# EAGLE design TPT02r (EAGLE 7.5.0)
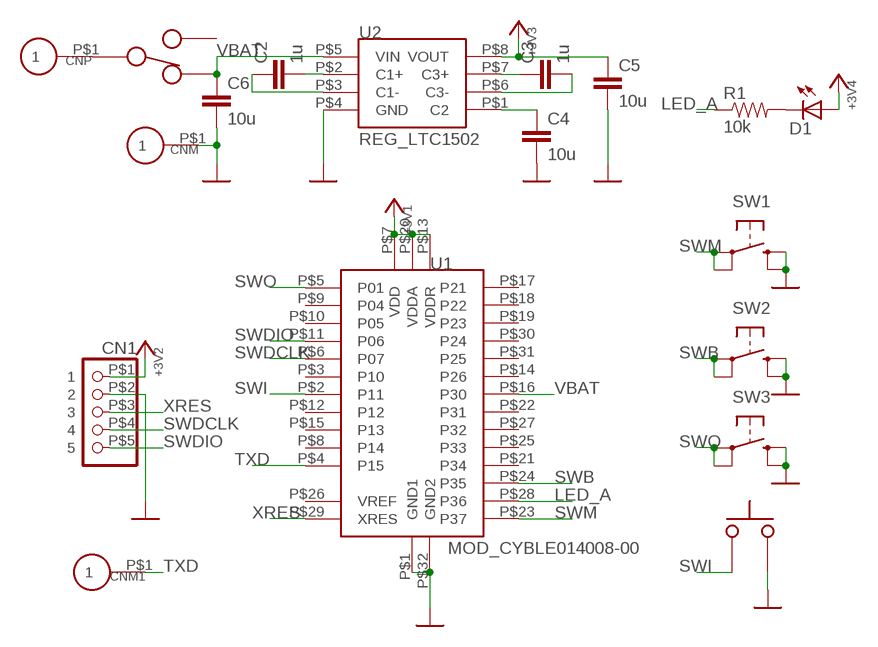
[diagram p0: schematic, sheet 1]

## Parts
C2  1u  CAP0603  [0603]
C3  1u  CAP0603  [0603]
C4  10u  CAP0603  [0603]
C5  10u  CAP0603  [0603]
C6  10u  CAP0603  [0603]
CN1  CON_PINHD-1X550MIL  [1X5_50MIL]
CNM  CON_P01SMD1MM  [PAD_SMD1MM]
CNM1  CON_P01SMD1MM  [PAD_SMD1MM]
CNP  CON_P01SMD1MM  [PAD_SMD1MM]
D1  LED0603  [SPARKFUN_LED-0603]
R1  10k  RES0603  [0603]
SW1  SW_TACTEVQP2  [SW_EVQP2]
SW2  SW_TACTTVAF17  [SW_TVAF17]
SW3  SW_TACTTVAF17  [SW_TVAF17]
SW4  SW_SLIDECUS12  [SW_CUS-12]
SW6  SW_TACT2PB3U3000  [SW_B3U-3000P]
U1  MOD_CYBLE014008-00  [MOD_CYBLE014008-00]
U2  REG_LTC1502  [MSOP8]

## Nets
+3V3: C5.1 CN1.P$1 D1.A U1.P$7(VDD) U1.P$13(VDDR) U1.P$20(VDDA) U2.P$8(VOUT) ; supply symbol labelled POW_+3V3
GND: C4.2 C5.2 C6.2 CN1.P$2 CNM.P$1 SW1.PB1(S) SW1.PB2(S1) SW2.P$3(S) SW2.P$4(S1) SW3.P$3(S) SW3.P$4(S1) SW6.P$1 U1.P$1(GND1) U1.P$32(GND2) U2.P$4(GND) ; supply symbol labelled POW_GND
LED_A: R1.1 U1.P$28(P36)
N$2: C4.1 U2.P$1(C2)
N$3: C2.2 U2.P$2(C1+)
N$4: C2.1 U2.P$3(C1-)
N$5: C3.1 U2.P$7(C3+)
N$6: C3.2 U2.P$6(C3-)
N$7: D1.C R1.2
N$8: CNP.P$1 SW4.P$2
SWB: SW2.P$1(P) SW2.P$2(P1) U1.P$24(P35)
SWDCLK: CN1.P$4 U1.P$6(P07)
SWDIO: CN1.P$5 U1.P$11(P06)
SWI: SW6.P$2 U1.P$2(P11)
SWM: SW1.PA1(P) SW1.PA2(P1) U1.P$23(P37)
SWO: SW3.P$1(P) SW3.P$2(P1) U1.P$5(P01)
TXD: CNM1.P$1 U1.P$4(P15)
VBAT: C6.1 SW4.P$1 U1.P$16(P30) U2.P$5(VIN)
XRES: CN1.P$3 U1.P$29(XRES)
Unconnected: U1.P$3(P10) U1.P$8(P14) U1.P$9(P04) U1.P$10(P05) U1.P$12(P12) U1.P$14(P26) U1.P$15(P13) U1.P$17(P21) U1.P$18(P22) U1.P$19(P23) U1.P$21(P34) U1.P$22(P31) U1.P$25(P33) U1.P$26(VREF) U1.P$27(P32) U1.P$30(P24) U1.P$31(P25)

## Power pins joined to a net without a drawn wire
P$3: SW4.P$3

## Library data of the parts
C2-C6 = akita:CAP: Capacitor Standard 0603 ceramic capacitor, and 0.1" leaded capacitor.
CN1 = akita:CON_PINHD-1X5: PIN HEADER
CNM CNM1 CNP = akita:CON_P01
D1 = akita:LED: LEDs Standard schematic elements and footprints for 5mm, 3mm, 1206, and 0603 sized LEDs. 5mm - Spark Fun Electronics SKU : COM-00529 (and others)
R1 = akita:RES: Resistor Basic schematic elements and footprints for 0603, 1206, and PTH resistors.
SW1-SW3 = akita:SW_TACT: OMRON SWITCH
SW4 = akita:SW_SLIDE
SW6 = akita:SW_TACT2P: OMRON SWITCH
U1 = akita:MOD_CYBLE014008-00: Cypress CYBLE014008-000
U2 = akita:REG_LTC1502: LinearTechnology LTC1502(-3.3), Charge-pump regulator

## Board
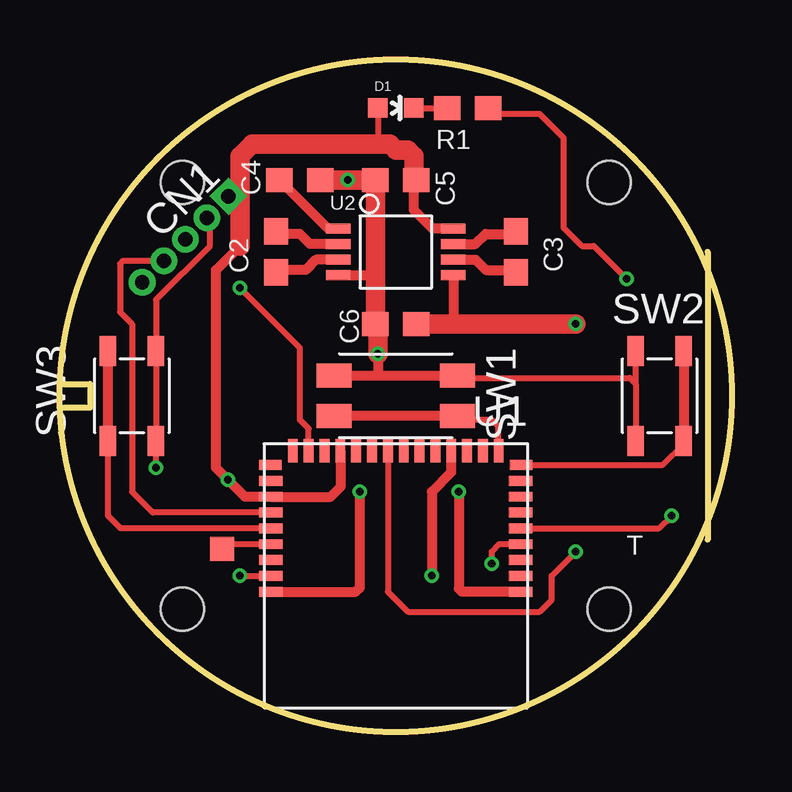
[diagram p1: board, top side]
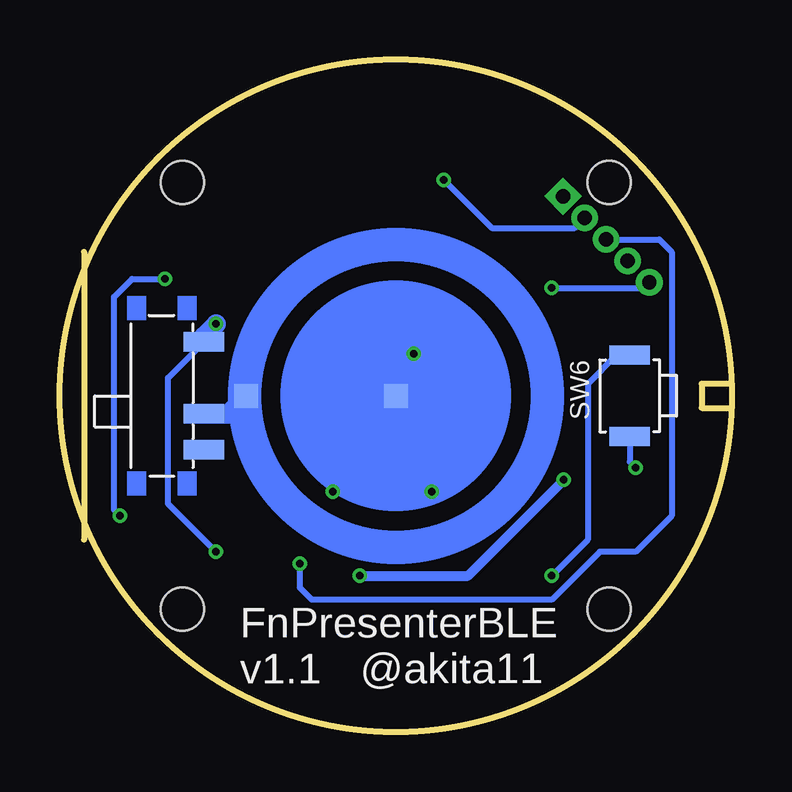
[diagram p2: board, bottom side, seen from below]

Size 28 x 28 mm. Coordinates in mm from the lower left corner, seen from the top.
Outline: 27,20 27,8
Outline: 0,14.5 1.25,14.5 1.25,13.5 0,13.5
Outline: circle at 14,14 radius 14
Copper layers (1*16): Top 0.035mm / dielectric 1.5mm / Bottom 0.035mm
Design rules "SeeedStudio_2layer_DRU_no_angle_20140221_Drill03mm": minimum track width 6mil, minimum drill 0.3mm, track to track 6mil, track to pad 6mil, pad to pad 6mil, via to via 6mil, smd to smd 0mil, copper to edge 10mil, drill to drill 10mil, minimum pad ring 10mil, minimum via ring 6mil, stop-mask expansion 2mil, vias tented up to drill 100mil, thermal gap 10mil
Holes 1.8 mm at 5.1,5.1 22.9,5.1 22.9,22.9 5.1,22.9

### Footprints (pad centres in the part's own frame; a part is rotated, then mirrored left to right if it is on the bottom)
0603 = smd 1.1 x 1: 1 -0.85,0; 2 0.85,0
1X5_50MIL = drill 0.6 square: P$1 0,2.54 | drill 0.6: P$2 0,1.27; P$3 0,0; P$4 0,-1.27; P$5 0,-2.54
PAD_SMD1MM = smd 1 x 1: P$1 0,0
SPARKFUN_LED-0603 = smd 0.8 x 0.8: A 0,-0.75; C 0,0.75
SW_EVQP2 = smd 1.45 x 1: PA1 -2.575,0.85; PA2 2.575,0.85; PB1 -2.575,-0.85; PB2 2.575,-0.85
SW_TVAF17 = smd 1.25 x 0.7: P$1 -1.875,1; P$2 1.875,1; P$3 -1.875,-1; P$4 1.875,-1
SW_CUS-12 = smd 0.813 x 1.676: P$1 -2.25,1.75; P$2 0.75,1.75; P$3 2.25,1.75
SW_B3U-3000P = smd 0.8 x 1.7: P$1 1.7,0; P$2 -1.7,0
MOD_CYBLE014008-00 = smd 0.99 x 0.41: P$1 5.205,0.67; P$2 5.205,0.01; P$3 5.205,-0.65; P$4 5.205,-1.31; P$5 5.205,-1.97; P$6 5.205,-2.63; P$7 5.205,-3.29; P$8 5.205,-3.95; P$25 -5.205,-3.95; P$26 -5.205,-3.29; P$27 -5.205,-2.63; P$28 -5.205,-1.97; P$29 -5.205,-1.31; P$30 -5.205,-0.65; P$31 -5.205,0.01; P$32 -5.205,0.67 | smd 0.94 x 0.41: P$9 5.23,-4.61; P$24 -5.23,-4.61 | smd 0.41 x 0.99: P$10 4.29,-5.205; P$11 3.63,-5.205; P$12 2.97,-5.205; P$13 2.31,-5.205; P$14 1.65,-5.205; P$15 0.99,-5.205; P$16 0.33,-5.205; P$17 -0.33,-5.205; P$18 -0.99,-5.205; P$19 -1.65,-5.205; P$20 -2.31,-5.205; P$21 -2.97,-5.205; P$22 -3.63,-5.205; P$23 -4.29,-5.205
MSOP8 = smd 0.41 x 1.02: P$1 -0.975,-2.4; P$2 -0.325,-2.4; P$3 0.325,-2.4; P$4 0.975,-2.4; P$5 0.975,2.4; P$6 0.325,2.4; P$7 -0.325,2.4; P$8 -0.975,2.4

### Placement (x,y rotation side)
C2  9,20 90 top
C3  19,20 270 top
C4  10,23 0 top
C5  14,23 180 top
C6  14,17 180 top
CN1  5.22,20.52 315 top
CNM  14,14 0 bottom
CNM1  6.75,7.62 0 top
CNP  20.25,14 0 bottom
D1  14,26 270 top
R1  17,26 180 top
SW1  14,14 180 top
SW2  25,14 270 top
SW3  3,14 90 top
SW4  23.75,14 270 bottom
SW6  4.25,14 270 bottom
U1  14,6.5 180 top
U2  14,20 270 top

### Tracks (layer width: path | path; a pad name or v marks a point on that pad's centre or on a via)
+3V3  (via drill 0.3)
  Top 0.254: 7.5,21.88 7.46,21.88 CN1.P$1 | D1.A 13.25,24.75 13.5,24.5
  Top 0.406: U2.P$8 15.53,20.98 14.75,21.75 14.75,22.9 C5.1 | 7.5,20.25 6.5,19.25 6.5,11 v7,10.5 7.71,9.79 U1.P$7 11.29,9.79 11.69,10.19 U1.P$13 | U1.P$20 16.31,10.81 15.5,10 v15.5,6.5
  Top 0.813: C5.1 14.75,23.1 14.75,24 14.5,24.25 14,24.25 13.75,24.5 13.5,24.5 8,24.5 7.5,24 7.5,21.88 7.5,20.25
  Bottom 0.406: v15.5,6.5 11,6.5 v7,10.5
GND  (via drill 0.3)
  Top 0.254: 16.68,14.75 23.75,14.75 24,14.5 | 24,14.5 SW2.P$4 | 24,14.5 SW2.P$3 | CN1.P$2 6.25,21.29 6.25,20.25 4,18 SW3.P$4 SW3.P$3 v4,11
  Top 0.406: U2.P$4 13.12,19.02 13.15,19 | SW1.PB2 13.25,14.85 | 13.25,14.85 SW1.PB1 16.68,14.75 | v13.25,15.75 13.25,14.85 | v16.62,10 16.62,5.96 16.75,5.83 U1.P$32 | U1.P$1 12.33,5.83 12.5,6 v12.5,10
  Top 0.813: v13.25,15.75 13.25,16.9 C6.2 13.15,19 C5.2 v12,23 C4.2
  Bottom 0.254: v12,23 10,21 6.54,21 CN1.P$2 | SW6.P$1 4.25,11.25 v4,11
  Bottom 0.406: CNM.P$1 16.62,11.38 v16.62,10 | CNM.P$1 12.75,12.75 12.75,10.5 12.5,10.25 v12.5,10 | 14,15 CNM.P$1
  Bottom 0.813: 14,15 v13.25,15.75
LED_A  (via drill 0.3)
  Top 0.254: R1.1 18.1,25.75 20,25.75 21,24.75 21,21 21.75,20.25 22.25,20.25 v23.62,18.88 | U1.P$28 24.97,8.47 v25.5,9
  Bottom 0.254: 23.75,18.75 v23.62,18.88 25,18.88 25.75,18.12 25.75,9.25 v25.5,9
N$2
  Top 0.406: U2.P$1 11.18,20.98 C4.1
N$3
  Top 0.406: U2.P$2 10.43,20.32 10,20.75 9.1,20.75 C2.2
N$4
  Top 0.406: U2.P$3 10.68,19.68 10.25,19.25 9.1,19.25 C2.1
N$5
  Top 0.406: U2.P$7 17.32,20.32 17.75,20.75 18.9,20.75 C3.1
N$6
  Top 0.406: U2.P$6 17.32,19.68 17.75,19.25 18.9,19.25 C3.2
N$7
  Top 0.254: D1.C R1.2
N$8
  Bottom 0.813: SW4.P$2 21,13.25 CNP.P$1
SWB
  Top 0.254: U1.P$24 25.11,11.11 26,12 SW2.P$2
  Top 0.406: SW2.P$1 SW2.P$2
SWDCLK
  Top 0.254: CN1.P$4 2.62,19.62 2.5,19.5 2.5,17.5 3,17 3,10 3.87,9.13 U1.P$6
SWDIO  (via drill 0.3)
  Top 0.254: U1.P$11 10.37,12.63 10,13 10,16 v7.5,18.5
  Bottom 0.254: v7.5,18.5 3.65,18.5 CN1.P$5
SWI  (via drill 0.3)
  Top 0.254: v7.5,6.5 U1.P$2
  Bottom 0.254: SW6.P$2 4.8,15.7 6,14.5 6,8 v7.5,6.5
SWM
  Top 0.254: U1.P$23 18.29,12.71 18,13 16.73,13 SW1.PA1
  Top 0.406: SW1.PA1 SW1.PA2
SWO
  Top 0.254: U1.P$5 2.53,8.47 2,9 SW3.P$1
  Top 0.406: SW3.P$1 SW3.P$2
TXD
  Top 0.254: U1.P$4 6.93,7.81 CNM1.P$1
VBAT  (via drill 0.3)
  Top 0.254: U1.P$16 13.67,5.83 14.5,5 20,5 20.5,5.5 20.5,6.5 v21.5,7.5
  Top 0.406: U2.P$5 16.4,17.15 16.25,17
  Top 0.813: v21.5,17 16.25,17 C6.1
  Bottom 0.254: 21.38,17.12 v21.5,17 | v21.5,7.5 23.5,9.5 23.5,14.75 SW4.P$1
  Bottom 0.813: SW4.P$1 22,16.5 v21.5,17
XRES  (via drill 0.3)
  Top 0.254: v18,7 18,7.5 18.31,7.81 U1.P$29
  Bottom 0.254: CN1.P$3 3.02,20.52 2.5,20 2.5,9 4,7.5 5.5,7.5 7.5,5.5 17.5,5.5 18,6 v18,7
(copper drawn outside any net)
  shapes: Bottom circle x2

### Text on the board
tPlace: T
bPlace: @akita11 | FnPresenterBLE / v1.1
Document: t=0.6mm